# EAGLE design MPC23S17-IO-Board (EAGLE 6.6.0)
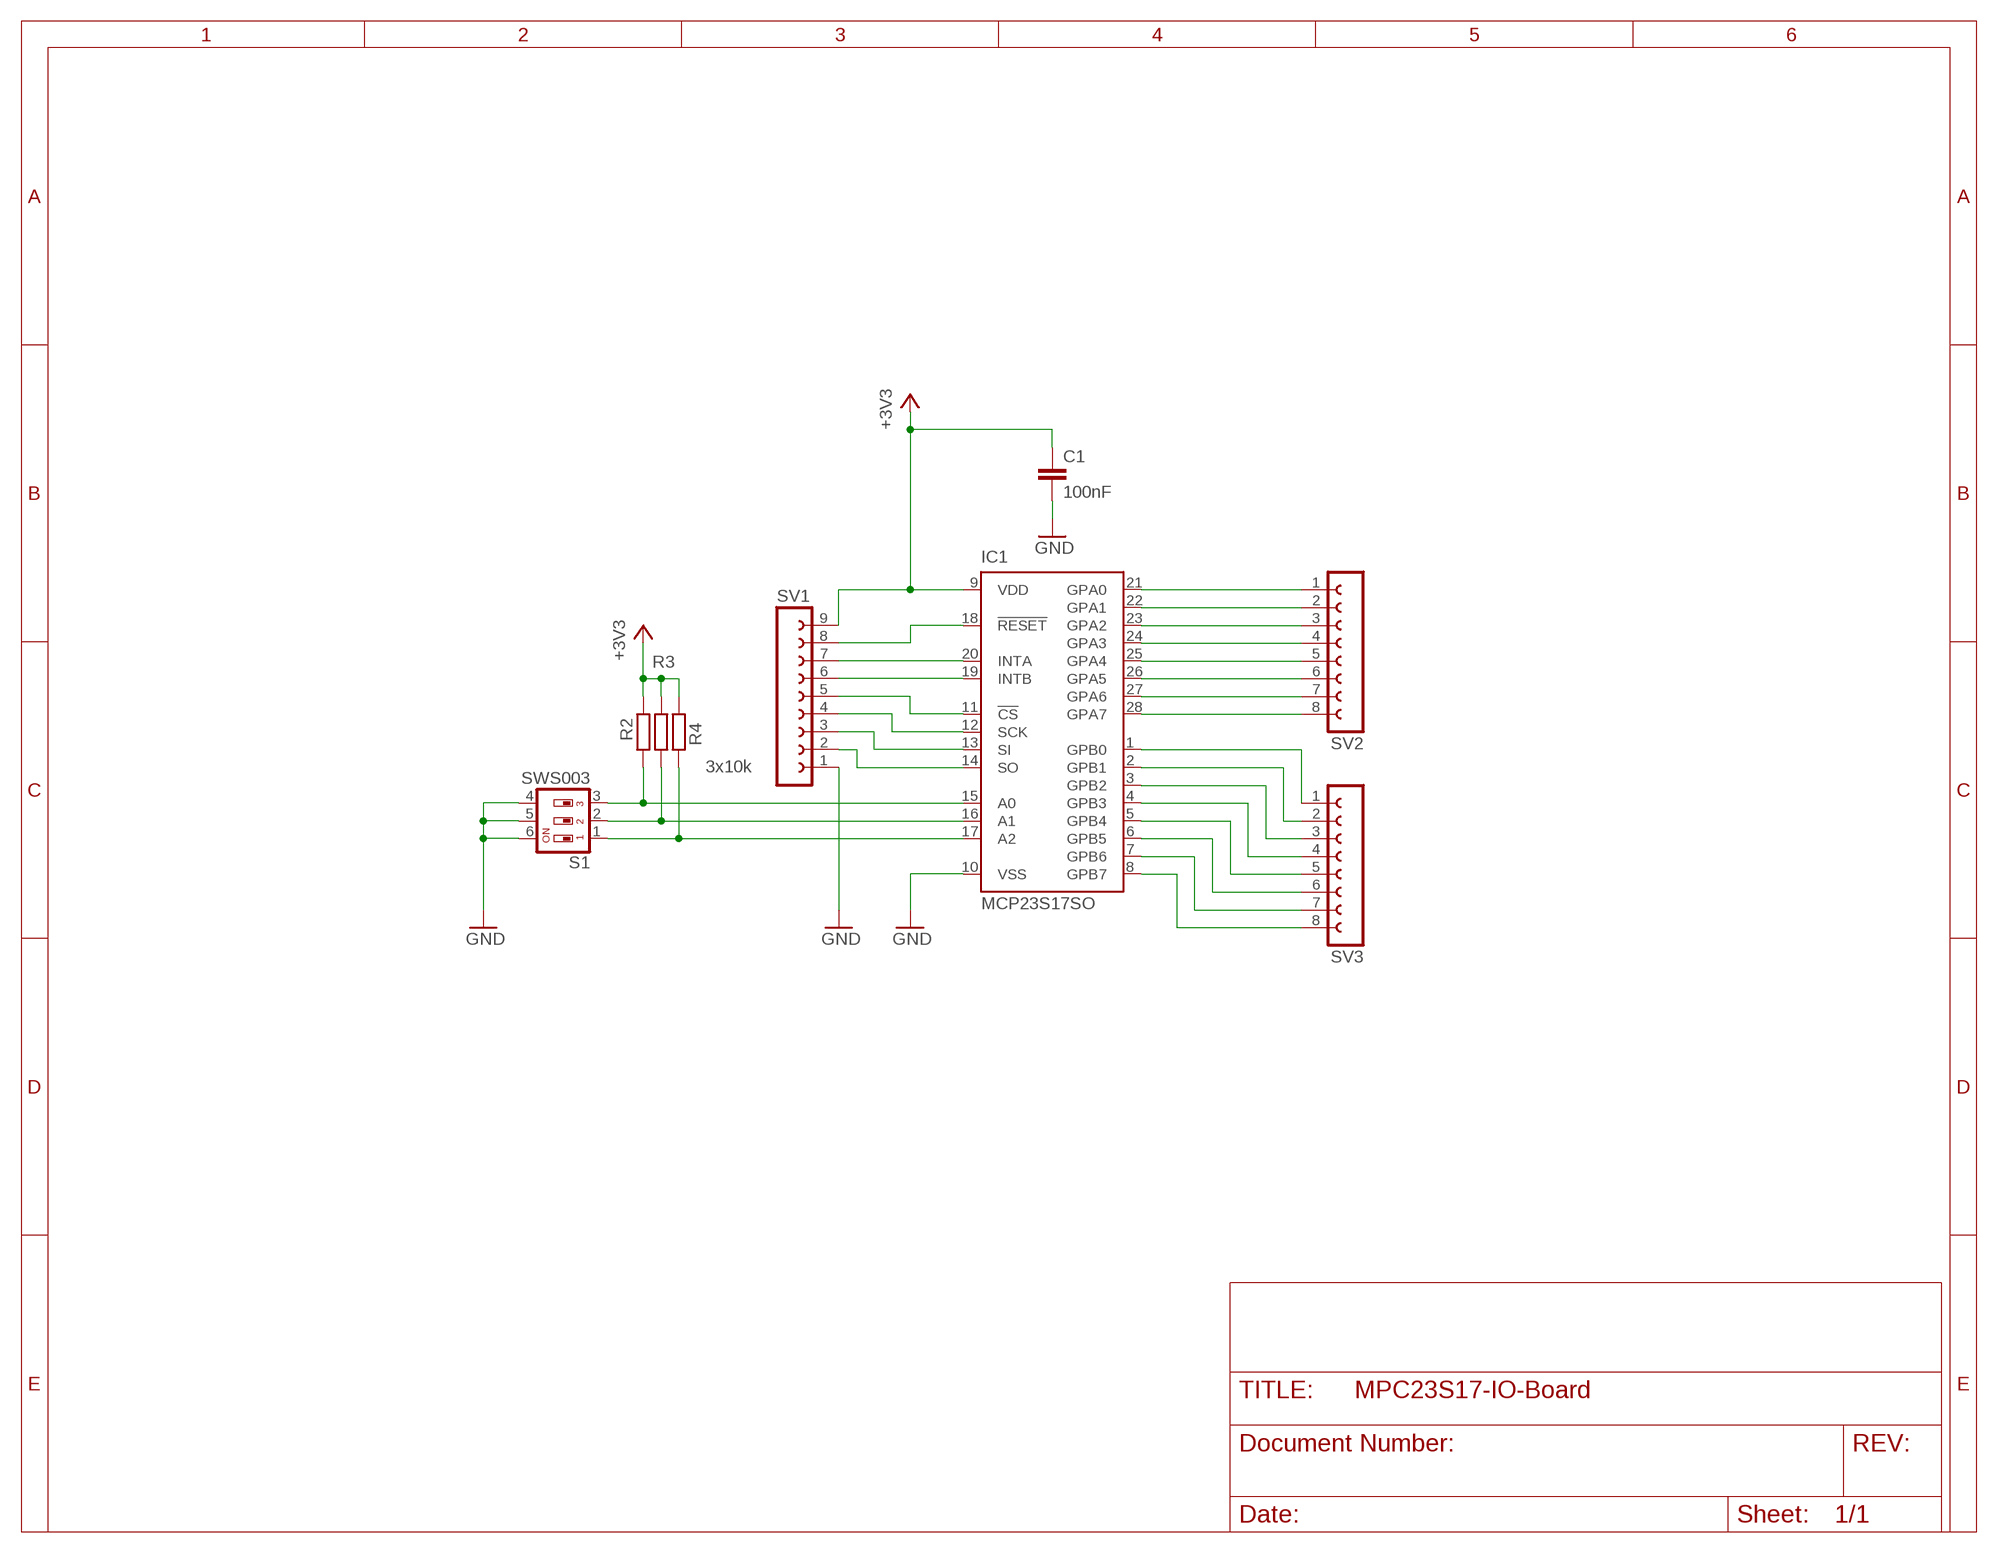
[diagram p0: schematic, sheet 1]

## Parts
C1  100nF  C-EUC1206  [C1206]
IC1  MCP23S17SO  [SO28W]
R2  10k  R-EU_M1206  [M1206]
R3  10k  R-EU_M1206  [M1206]
R4  3x10k  R-EU_M1206  [M1206]
S1  SWS003  [SMS-003]
SV1  FE09-1  [FE09]
SV2  FE08-1  [FE08]
SV3  FE08-1  [FE08]

## Nets
+3V3: C1.1 IC1.9(VDD) R2.1 R3.1 R4.1 SV1.9
GND: C1.2 IC1.10(VSS) S1.4 S1.5 S1.6 SV1.1
N$1: IC1.21(GPA0) SV2.1
N$2: IC1.22(GPA1) SV2.2
N$3: IC1.23(GPA2) SV2.3
N$4: IC1.24(GPA3) SV2.4
N$5: IC1.25(GPA4) SV2.5
N$6: IC1.26(GPA5) SV2.6
N$7: IC1.27(GPA6) SV2.7
N$8: IC1.28(GPA7) SV2.8
N$9: IC1.1(GPB0) SV3.1
N$10: IC1.2(GPB1) SV3.2
N$11: IC1.3(GPB2) SV3.3
N$12: IC1.4(GPB3) SV3.4
N$13: IC1.5(GPB4) SV3.5
N$14: IC1.15(A0) R2.2 S1.3
N$15: IC1.16(A1) R3.2 S1.2
N$16: IC1.17(A2) R4.2 S1.1
N$17: IC1.6(GPB5) SV3.6
N$18: IC1.7(GPB6) SV3.7
N$19: IC1.19(INTB) SV1.6
N$20: IC1.14(SO) SV1.2
N$21: IC1.13(SI) SV1.3
N$22: IC1.12(SCK) SV1.4
N$23: IC1.11(!CS) SV1.5
N$24: IC1.20(INTA) SV1.7
N$25: IC1.18(!RESET) SV1.8
N$26: IC1.8(GPB7) SV3.8

## Library data of the parts
C1 = rcl:C-EU: CAPACITOR, European symbol
IC1 = microchip:MCP23S17: http://ww1.microchip.com/downloads/en/DeviceDoc/21952a.pdf Source: http://ww1.microchip.com/downloads/en/DeviceDoc/21952a.pdf
R2-R4 = rcl:R-EU_: RESISTOR, European symbol
S1 = smd-special:SWS003: SMD Dip Switch 3 pol.
SV1 = con-lsta:FE09-1: FEMALE HEADER
SV2 SV3 = con-lsta:FE08-1: FEMALE HEADER

## Board
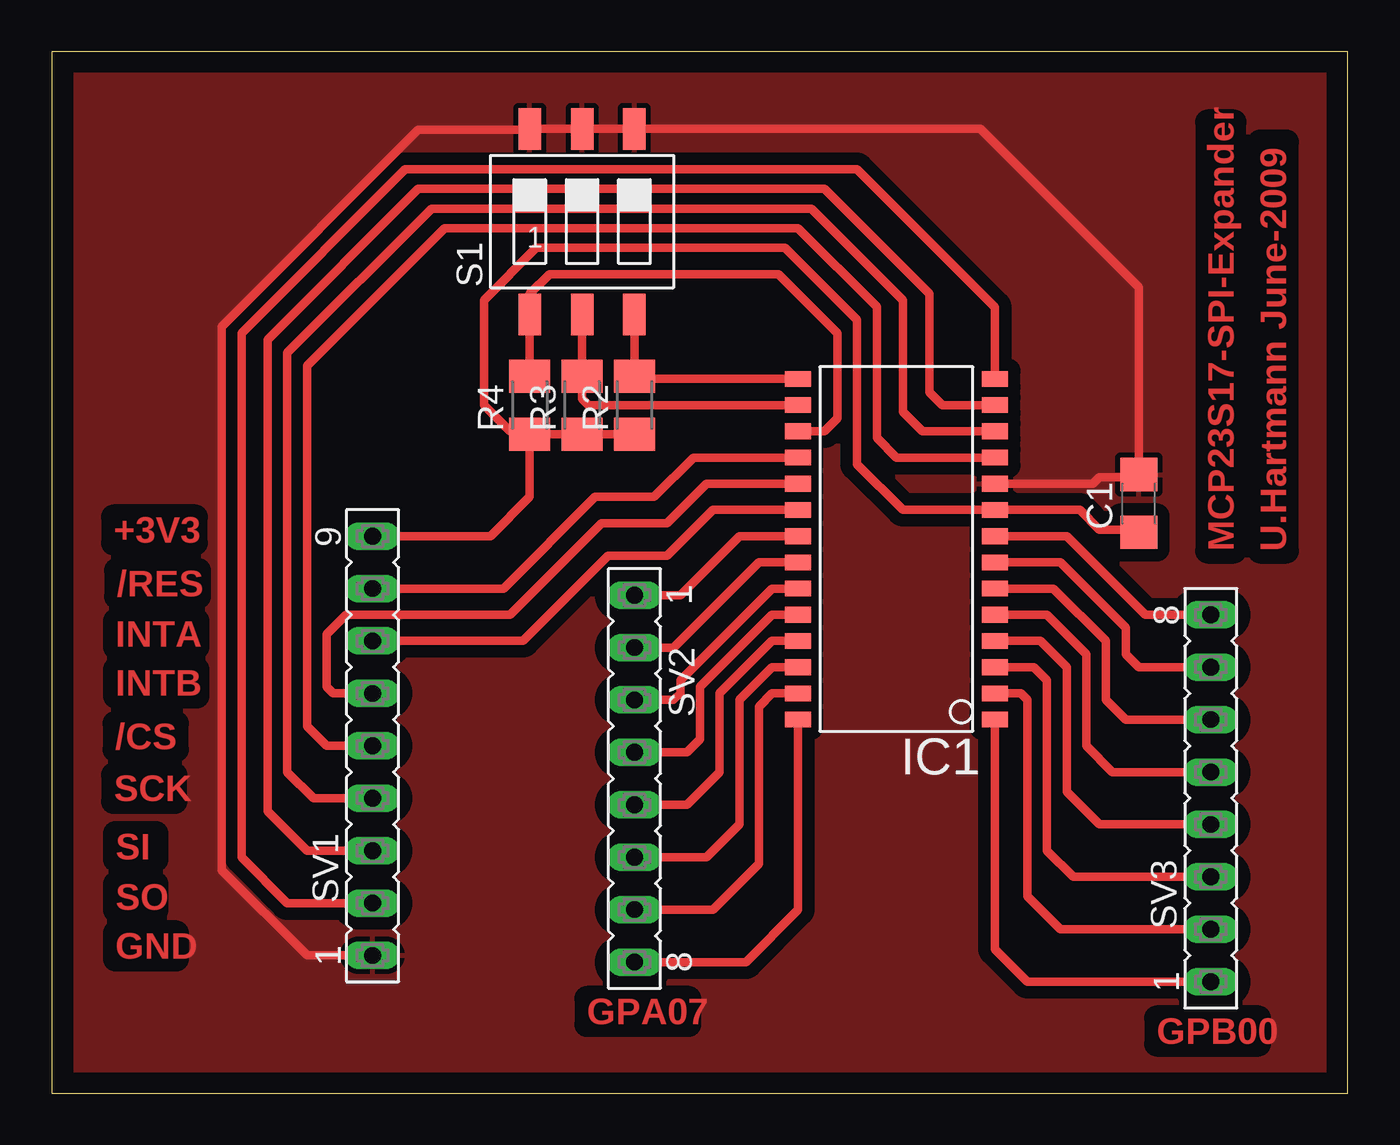
[diagram p1: board, top side]

Size 62.84 x 50.47 mm. Coordinates in mm from the lower left corner, seen from the top.
Outline: 0,0 62.84,0 62.84,50.47 0,50.47 0,0
Copper layers (1*16): Top 0.035mm / dielectric 1.5mm / Bottom 0.035mm
Design rules "default": minimum track width 10mil, minimum drill 24mil, track to track 8mil, track to pad 8mil, pad to pad 8mil, via to via 8mil, smd to smd 8mil, copper to edge 40mil, drill to drill 8mil, minimum pad ring 10mil, minimum via ring 8mil, stop-mask expansion 4mil, vias tented up to drill 0mil, thermal gap 10mil

### Footprints (pad centres in the part's own frame; a part is rotated, then mirrored left to right if it is on the bottom)
C1206 = smd 1.6 x 1.8: 1 -1.4,0; 2 1.4,0
SO28W = smd 0.762 x 1.27: 1 -7.62,-4.78; 2 -6.35,-4.78; 3 -5.08,-4.78; 4 -3.81,-4.78; 5 -2.54,-4.78; 6 -1.27,-4.78; 7 0,-4.78; 8 1.27,-4.78; 9 2.54,-4.78; 10 3.81,-4.78; 11 5.08,-4.78; 12 6.35,-4.78; 13 7.62,-4.78; 14 8.89,-4.78; 15 8.89,4.78; 16 7.62,4.78; 17 6.35,4.78; 18 5.08,4.78; 19 3.81,4.78; 20 2.54,4.78; 21 1.27,4.78; 22 0,4.78; 23 -1.27,4.78; 24 -2.54,4.78; 25 -3.81,4.78; 26 -5.08,4.78; 27 -6.35,4.78; 28 -7.62,4.78
M1206 = smd 1.6 x 2: 1 -1.4,0; 2 1.4,0
SMS-003 = smd 1.092 x 2.007: 1 -2.54,-4.496; 2 0,-4.496; 3 2.54,-4.496; 4 2.54,4.496; 5 0,4.496; 6 -2.54,4.496
FE09 = drill 0.813 long: 1 -10.16,0; 2 -7.62,0; 3 -5.08,0; 4 -2.54,0; 5 0,0; 6 2.54,0; 7 5.08,0; 8 7.62,0; 9 10.16,0
FE08 = drill 0.813 long: 1 -8.89,0; 2 -6.35,0; 3 -3.81,0; 4 -1.27,0; 5 1.27,0; 6 3.81,0; 7 6.35,0; 8 8.89,0

### Placement (x,y rotation side)
C1  52.7,28.57 90 top
IC1  40.96,25.72 90 top
R2  28.26,33.34 90 top
R3  25.72,33.34 90 top
R4  23.18,33.34 90 top
S1  25.72,42.23 0 top
SV1  15.56,16.83 90 top
SV2  28.26,15.24 270 top
SV3  56.2,14.29 90 top

### Tracks (layer width: path | path; a pad name or v marks a point on that pad's centre or on a via)
+3V3
  Top 0.406: C1.1 52.58,27.3 50.8,27.3 49.85,28.26 IC1.9 41.27,28.26 39.05,30.48 39.05,37.47 35.56,40.96 23.5,40.96 20.95,38.42 20.95,33.34 22.23,32.07 23.05,32.07 R4.1 | R4.1 22.99,31.75 | R4.1 R3.1 R2.1 | SV1.9 21.27,26.99 23.18,28.89 R4.1
GND
  Top 0.406: IC1.10 50.48,29.53 50.8,29.84 52.58,29.84 C1.2 | C1.2 52.84,29.84 | C1.2 52.7,39.05 45.03,46.72 S1.4 S1.5 S1.6 23.13,46.67 17.78,46.67 8.26,37.15 8.26,10.79 12.38,6.67 SV1.1
  pour Top (isolate 0.61): 0.64,0.32 0.64,50.16 62.55,50.16 62.55,0.32
N$1
  Top 0.406: IC1.21 33.34,26.99 30.48,24.13 SV2.1
N$2
  Top 0.406: IC1.22 34.29,25.72 30.16,21.59 SV2.2
N$3
  Top 0.406: IC1.23 34.92,24.45 30.48,20 30.48,19.37 30.16,19.05 SV2.3
N$4
  Top 0.406: IC1.24 34.92,23.18 31.43,19.68 31.43,17.14 30.8,16.51 SV2.4
N$5
  Top 0.406: IC1.25 34.92,21.91 32.38,19.37 32.38,15.56 30.8,13.97 SV2.5
N$6
  Top 0.406: IC1.26 34.92,20.64 33.34,19.05 33.34,13.02 31.75,11.43 SV2.6
N$7
  Top 0.406: IC1.27 34.92,19.37 34.29,18.73 34.29,11.11 32.07,8.89 SV2.7
N$8
  Top 0.406: IC1.28 36.18,8.87 33.66,6.35 SV2.8
N$9
  Top 0.406: IC1.1 45.74,6.97 47.31,5.4 SV3.1
N$10
  Top 0.406: IC1.2 46.99,19.37 47.31,19.05 47.31,9.53 48.9,7.94 SV3.2
N$11
  Top 0.406: IC1.3 47.62,20.64 48.26,20 48.26,11.75 49.53,10.48 SV3.3
N$12
  Top 0.406: IC1.4 47.94,21.91 49.21,20.64 49.21,14.61 50.8,13.02 SV3.4
N$13
  Top 0.406: IC1.5 48.26,23.18 50.16,21.27 50.16,16.83 51.44,15.56 SV3.5
N$14
  Top 0.406: S1.3 R2.2 28.39,34.61 IC1.15
N$15
  Top 0.406: S1.2 R3.2 25.72,33.66 26.04,33.34 IC1.16
N$16
  Top 0.406: R4.2 S1.1 23.18,38.73 24.13,39.69 35.24,39.69 38.1,36.83 38.1,32.7 37.47,32.07 IC1.17
N$17
  Top 0.406: IC1.6 48.58,24.45 51.12,21.91 51.12,19.05 52.07,18.1 SV3.6
N$18
  Top 0.406: IC1.7 48.9,25.72 52.07,22.54 52.07,21.27 52.7,20.64 SV3.7
N$19
  Top 0.406: IC1.19 31.75,29.53 29.84,27.62 26.67,27.62 22.23,23.18 14.29,23.18 13.34,22.23 13.34,19.68 13.65,19.37 SV1.6
N$20
  Top 0.406: SV1.2 11.43,9.21 9.21,11.43 9.21,36.83 17.14,44.77 39.05,44.77 45.74,38.08 IC1.14
N$21
  Top 0.406: IC1.13 43.18,33.34 42.55,33.97 42.55,38.73 37.47,43.81 17.78,43.81 10.48,36.51 10.48,13.65 12.38,11.75 SV1.3
N$22
  Top 0.406: IC1.12 42.23,32.07 41.27,33.02 41.27,38.42 36.83,42.86 18.41,42.86 11.43,35.88 11.43,15.56 12.7,14.29 SV1.4
N$23
  Top 0.406: IC1.11 40.96,30.8 40.01,31.75 40.01,38.1 36.2,41.91 19.05,41.91 12.38,35.24 12.38,17.78 13.34,16.83 SV1.5
N$24
  Top 0.406: IC1.20 32.07,28.26 29.84,26.04 26.99,26.04 22.86,21.91 SV1.7
N$25
  Top 0.406: IC1.18 31.11,30.8 29.21,28.89 26.35,28.89 21.91,24.45 SV1.8
N$26
  Top 0.406: IC1.8 49.21,26.99 53.02,23.18 SV3.8

### Text on the board
Top: +3V3 | MCP23S17-SPI-Expander | U.Hartmann June-2009 | /RES | INTA | INTB | /CS | SCK | SI | SO | GND | GPA07 | GPB00